# EAGLE design +(3.3, 5, 9, 12) (EAGLE 9.6.2)
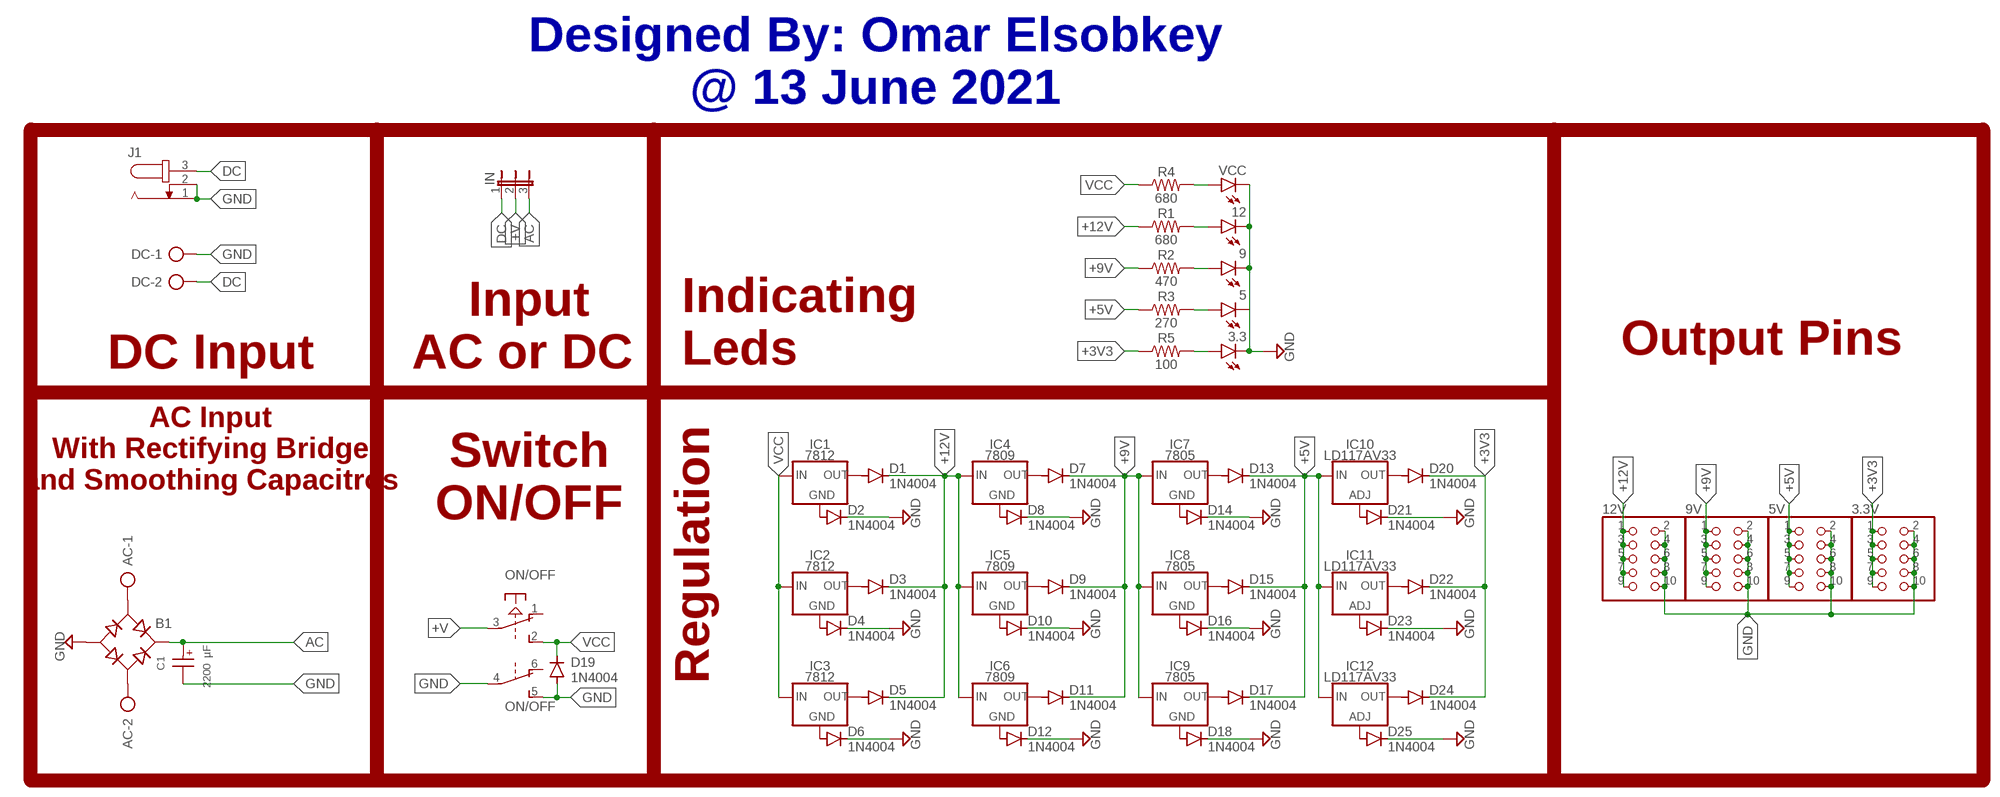
[diagram p0: schematic, sheet 1]

## Parts
3.3  LED5MM  [LED5MM]
3.3V  PINHD-2X5  [2X05]
5  LED5MM  [LED5MM]
5V  PINHD-2X5  [2X05]
9  LED5MM  [LED5MM]
9V  PINHD-2X5  [2X05]
12  LED5MM  [LED5MM]
12V  PINHD-2X5  [2X05]
AC  AK500/2-H  [AK500/2-H]
B1  RB1A  [RB1A]
C1  2200 µF  WCAP-ATG8_16X25_860010580021  [WCAP-ATG8_16X25(DXL)]
D1  1N4004  [DO41-10]
D2  1N4004  [DO41-10]
D3  1N4004  [DO41-10]
D4  1N4004  [DO41-10]
D5  1N4004  [DO41-10]
D6  1N4004  [DO41-10]
D7  1N4004  [DO41-10]
D8  1N4004  [DO41-10]
D9  1N4004  [DO41-10]
D10  1N4004  [DO41-10]
D11  1N4004  [DO41-10]
D12  1N4004  [DO41-10]
D13  1N4004  [DO41-10]
D14  1N4004  [DO41-10]
D15  1N4004  [DO41-10]
D16  1N4004  [DO41-10]
D17  1N4004  [DO41-10]
D18  1N4004  [DO41-10]
D19  1N4004  [DO41-10]
D20  1N4004  [DO41-10]
D21  1N4004  [DO41-10]
D22  1N4004  [DO41-10]
D23  1N4004  [DO41-10]
D24  1N4004  [DO41-10]
D25  1N4004  [DO41-10]
DC  AK500/2-H  [AK500/2-H]
IC1  7812  78XXS  [78XXS]
IC2  7812  78XXS  [78XXS]
IC3  7812  78XXS  [78XXS]
IC4  7809  78XXS  [78XXS]
IC5  7809  78XXS  [78XXS]
IC6  7809  78XXS  [78XXS]
IC7  7805  78XXS  [78XXS]
IC8  7805  78XXS  [78XXS]
IC9  7805  78XXS  [78XXS]
IC10  LD117AV33  [TO220L1]
IC11  LD117AV33  [TO220L1]
IC12  LD117AV33  [TO220L1]
IN  JP2E  [JP2]
J1  JACK-PLUG0  [SPC4077]
ON/OFF  PVA2R  [PVA2R]
R1  680  RESISTORAXIAL-0.3  [AXIAL-0.3]
R2  470  RESISTORAXIAL-0.3  [AXIAL-0.3]
R3  270  RESISTORAXIAL-0.3  [AXIAL-0.3]
R4  680  RESISTORAXIAL-0.3  [AXIAL-0.3]
R5  100  RESISTORAXIAL-0.3  [AXIAL-0.3]
VCC  LED5MM  [LED5MM]

## Nets
+3V3: 3.3V.1 3.3V.3 3.3V.5 3.3V.7 3.3V.9 D20.C D22.C D24.C R5.P$1
+5V: 5V.1 5V.3 5V.5 5V.7 5V.9 D13.C D15.C D17.C IC10.3(IN) IC11.3(IN) IC12.3(IN) R3.P$1
+9V: 9V.1 9V.3 9V.5 9V.7 9V.9 D7.C D9.C D11.C IC7.IN IC8.IN IC9.IN R2.P$1
+12V: 12V.1 12V.3 12V.5 12V.7 12V.9 D1.C D3.C D5.C IC4.IN IC5.IN IC6.IN R1.P$1
+V: IN.2 ON/OFF.3(1:P)
AC: B1.+ C1.1(+) IN.3
DC: DC.2 IN.1 J1.3
GND: 3.3.K(C) 3.3V.2 3.3V.4 3.3V.6 3.3V.8 3.3V.10 5.K(C) 5V.2 5V.4 5V.6 5V.8 5V.10 9.K(C) 9V.2 9V.4 9V.6 9V.8 9V.10 12.K(C) 12V.2 12V.4 12V.6 12V.8 12V.10 B1.- C1.2(-) D2.C D4.C D6.C D8.C D10.C D12.C D14.C D16.C D18.C D19.A D21.C D23.C D25.C DC.1 J1.1 J1.2 ON/OFF.4(2:P) ON/OFF.5(2:S) VCC.K(C)
N$1: AC.1 B1.AC1
N$2: AC.2 B1.AC2
N$3: 3.3.A R5.P$2
N$4: R4.P$2 VCC.A
N$5: D21.A IC10.1(ADJ)
N$6: D1.A IC1.OUT
N$7: D2.A IC1.GND
N$8: D3.A IC2.OUT
N$9: D4.A IC2.GND
N$10: D5.A IC3.OUT
N$11: D6.A IC3.GND
N$12: D7.A IC4.OUT
N$13: D8.A IC4.GND
N$14: D9.A IC5.OUT
N$15: D10.A IC5.GND
N$16: D11.A IC6.OUT
N$17: D12.A IC6.GND
N$18: D13.A IC7.OUT
N$19: D14.A IC7.GND
N$20: D15.A IC8.OUT
N$21: D16.A IC8.GND
N$22: D17.A IC9.OUT
N$23: D18.A IC9.GND
N$24: 12.A R1.P$2
N$25: 9.A R2.P$2
N$26: 5.A R3.P$2
N$27: D22.A IC11.2(OUT)
N$28: D23.A IC11.1(ADJ)
N$29: D24.A IC12.2(OUT)
N$30: D25.A IC12.1(ADJ)
N$31: D20.A IC10.2(OUT)
VCC: D19.C IC1.IN IC2.IN IC3.IN ON/OFF.2(1:S) R4.P$1
Unconnected: ON/OFF.1(1:O) ON/OFF.6(2:O)

## Notes on the sheet
- Designed By: Omar Elsobkey
  @ 13 June 2021
- DC Input | Output Pins
- Input
  AC or DC
- Indicating
  Leds
- AC Input
  With Rectifying Bridge
  and Smoothing Capacitros
- Switch
  ON/OFF
- Regulation

## Library data of the parts
3.3 5 9 12 VCC = led:LED: LED OSRAM: - CHIPLED LG R971, LG N971, LY N971, LG Q971, LY Q971, LO R971, LY R971 LH N974, LH R974 LS Q976, LO Q976, LY Q976 LO Q996 - Hyper CHIPLED LW Q18S LB Q993, LB Q99A, LB R99A - SideLED LS A670, LO A670, LY A670, LG A670, LP A670 LB A673, LV A673, LT A673, LW A673 LH A674 LY A675 LS A676, LA A676, LO A676, LY A676, LW A676 LS A679, LY A679, LG A679 - Hyper Micro SIDELED® LS Y876, LA Y876, LO Y876, LY Y876 LT Y87S - SmartLED LW L88C, LW L88S LB L89C, LB L89S, LG L890 LS L89K, LO L89K, LY L89K LS L896, LA L896, LO L896, LY L896 - TOPLED LS T670, LO T670, LY T670, LG T670, LP T670 LSG T670, LSP T670, LSY T670, LOP T670, LYG T670 LG T671, LOG T671, LSG T671 LB T673, LV T673, LT T673, LW T673 LH T674 LS T676, LA T676, LO T676, LY T676, LB T676, LH T676, LSB T676, LW T676 LB T67C, LV T67C, LT T67C, LS T67K, LO T67K, LY T67K, LW E67C LS E67B, LA E67B, LO E67B, LY E67B, LB E67C, LV E67C, LT E67C LW T67C LS T679, LY T679, LG T679 LS T770, LO T770, LY T770, LG T770, LP T770 LB T773, LV T773, LT T773, LW T773 LH T774 LS E675, LA E675, LY E675, LS T675 LS T776, LA T776, LO T776, LY T776, LB T776 LHGB T686 LT T68C, LB T68C - Hyper Mini TOPLED® LB M676 - Mini TOPLED Santana® LG M470 LS M47K, LO M47K, LY M47K Source: http://www.osram.convergy.de LUXEON: - LUMILED® LXK2-PW12-R00, LXK2-PW12-S00, LXK2-PW14-U00, LXK2-PW14-V00 LXK2-PM12-R00, LXK2-PM12-S00, LXK2-PM14-U00 LXK2-PE12-Q00, LXK2-PE12-R00, LXK2-PE12-S00, LXK2-PE14-T00, LXK2-PE14-U00 LXK2-PB12-K00, LXK2-PB12-L00, LXK2-PB12-M00, LXK2-PB14-N00, LXK2-PB14-P00, LXK2-PB14-Q00 LXK2-PR12-L00, LXK2-PR12-M00, LXK2-PR14-Q00, LXK2-PR14-R00 LXK2-PD12-Q00, LXK2-PD12-R00, LXK2-PD12-S00 LXK2-PH12-R00, LXK2-PH12-S00 LXK2-PL12-P00, LXK2-PL12-Q00, LXK2-PL12-R00 Source: www.luxeon.com KINGBRIGHT: KA-3528ASYC Source: www.kingbright.com
3.3V 5V 9V 12V = pinhead:PINHD-2X5: PIN HEADER
AC DC = con-ptr500:AK500/2-H: CONNECTOR Aug. 2004 / PTR Meßtechnik: Die Bezeichnung der Serie AK505 wurde geändert. Es handelt sich hierbei um AK500 in horizontaler Ausführung.; OC_FARNELL: unknown; OC_NEWARK: unknown
B1 = rectifier:RB1A: RECTIFIER 1 A
C1 = Wurth_Capacitors_WCAP-ATG8:WCAP-ATG8_16X25: WCAP-ATG8 Aluminium Electrolytic Capacitors General Purpose +85 °C Characteristics General purpose product series with max. operating temperature of +85 °C Wide range of capacitance value Mounting style: THT Radial Capacitance range: 0.1 µF ‒ 33000 µF Capacitance tolerance: ±20 % Voltage range (UR): 10 ‒ 400 V(DC) Operating temperature: -40 °C up to +85 °C for UR < 400 V(DC) -25 °C up to +85 °C for UR ≥ 400 V(DC) Endurance: 2000 h @ +85 °C Dimensions (DxL) in mm: 5.0 x 11.0 up to 22.0 x 51.0 Recommended soldering: Wave soldering Applications Filtering Smoothing Energy storage Coupling <https://www.we-online.com/catalog/media/o35732v209%20WCAP-ATG8_4C.jpg> Details see: https://www.we-online.com/catalog/en/WCAP-ATG8/ Updated by yingchun,Shan;2020-02-27 2020(C) Würth Elektronik; DATASHEET-URL: https://www.we-online.com/catalog/datasheet/860010580021.pdf; DF: 12%; DIAMETER: 16mm; I-LEAK: 770uA; I-RIPPLE: 1870mA; L: 25mm; OPERATING-TEMPERATURE: -40 °C up to +85 °C; PART-NUMBER: 860010580021; PITCH: 7.5mm; TECHNICAL-REFERENCE: ATBK250222M035DSPAEB000; VR: 35V(DC)
D1-D25 = diode:1N4004: DIODE general purpose rectifier, 1 A
IC1-IC9 = v-reg:78XXS: VOLTAGE REGULATOR
IC10-IC12 = v-reg:LD117A?*: Low drop fixed and adjustable positive voltage regulators 1 A Source: http://www.st.com/stonline/products/literature/ds/7194/ld1117axx.pdf
IN = jumper:JP2E: JUMPER
J1 = con-jack:JACK-PLUG: DC POWER JACK Power Jack, DC, Right Angle, Through Hole, Rated 5A at 16VDC, PC Terminals Distributor: Farnell (www.Farnell.de) Drawing: 84N1161.pdf / 84N1162.pdf Manufacturer: SPC Technology (www.spctechnology.com) Type: SPC4077 / SPC 4078; OC_FARNELL: unknown; OC_NEWARK: unknown
ON/OFF = switch-misc:PVA2R: ITT SWITCH
R1-R5 = SparkFun-Resistors:RESISTOR: Generic Resistor Package

## Board
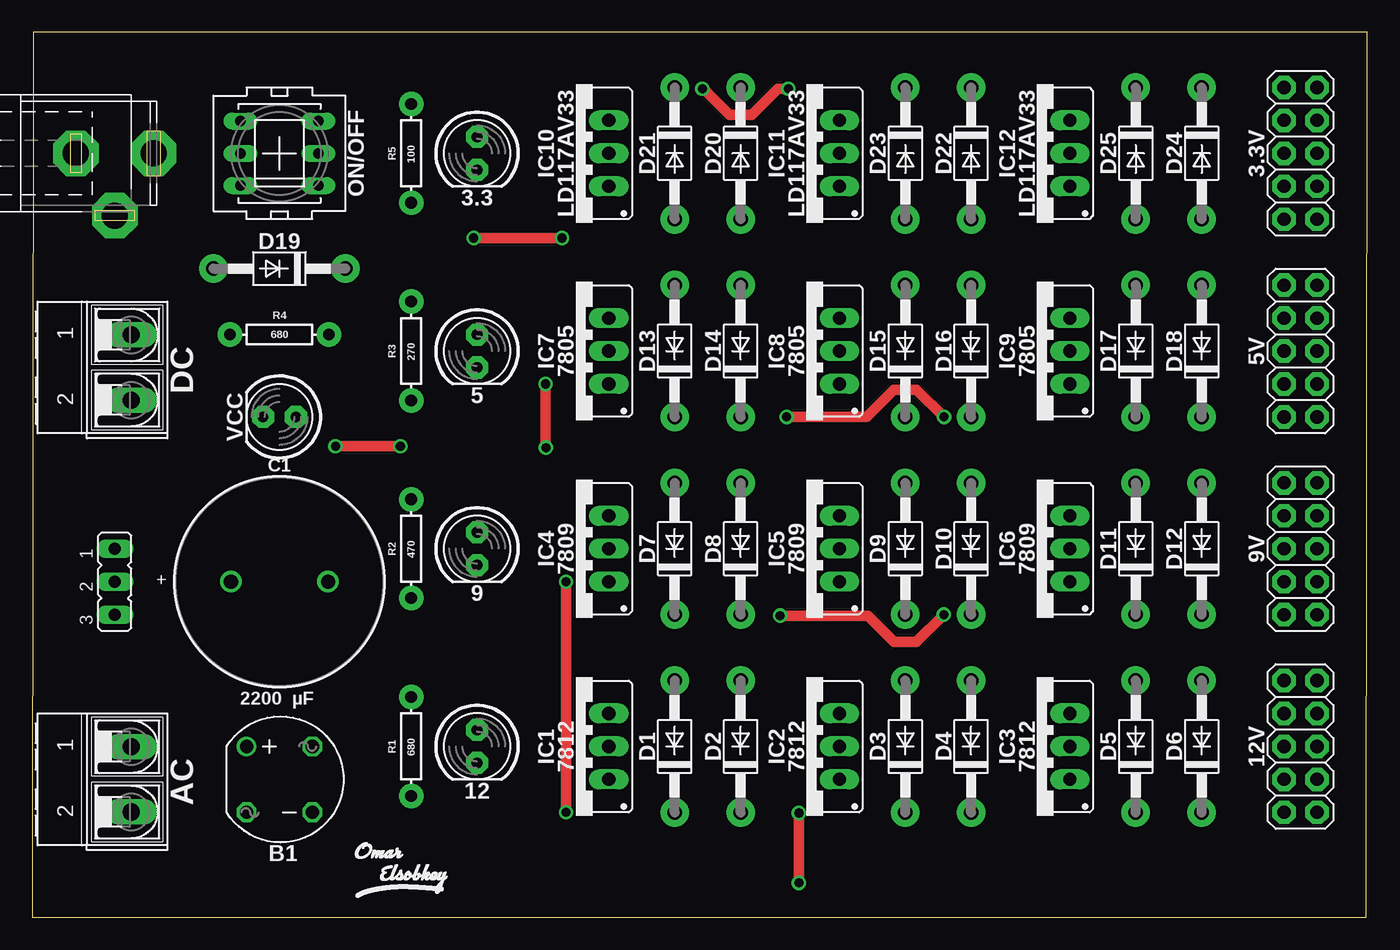
[diagram p1: board, top side]
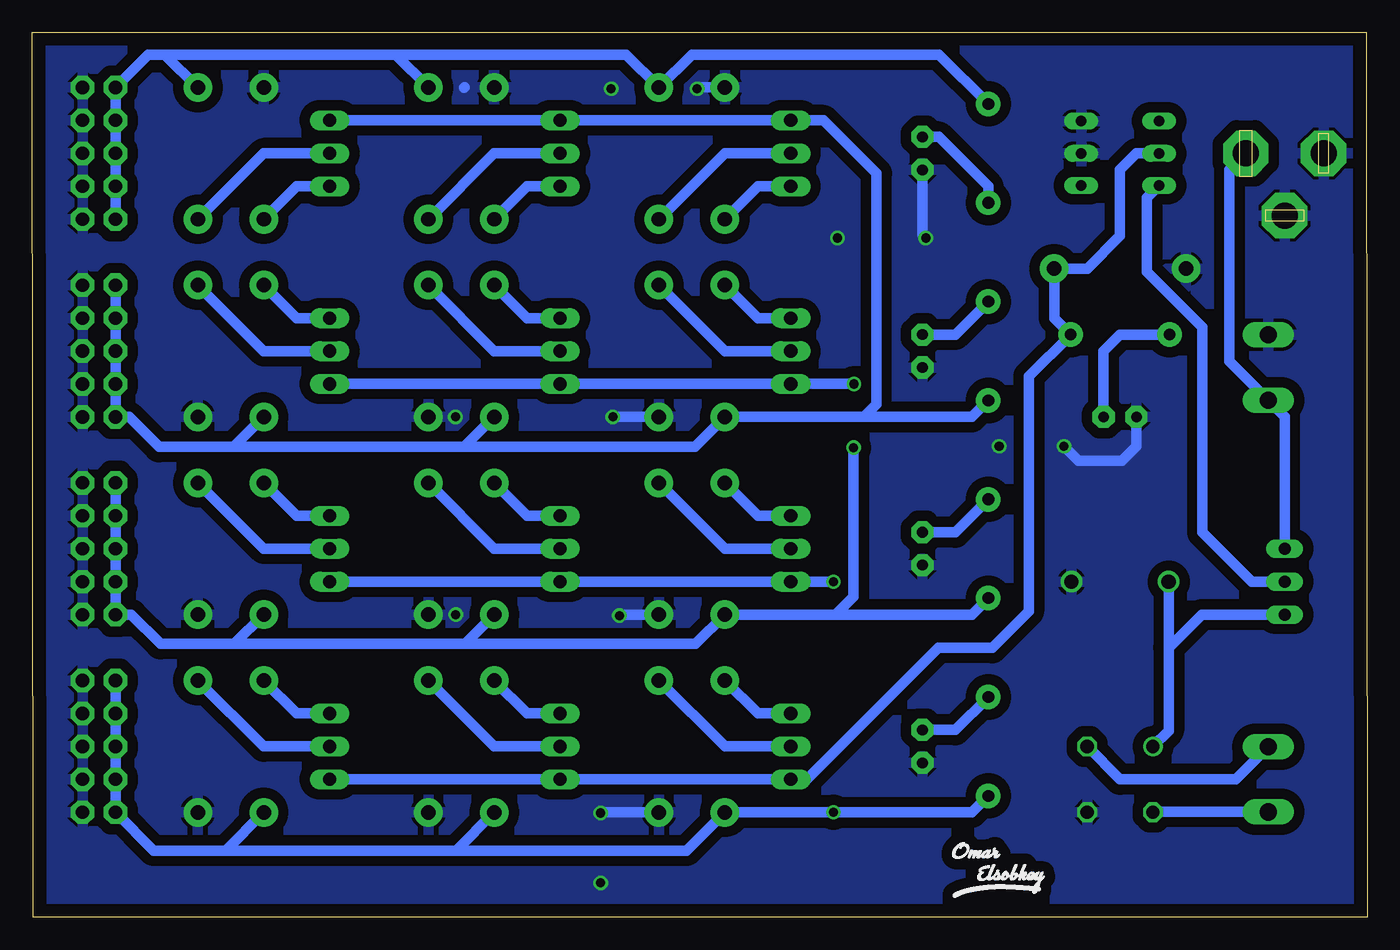
[diagram p2: board, bottom side, seen from below]

Size 102.93 x 68.2 mm. Coordinates in mm from the lower left corner, seen from the top.
Outline: 0,0 102.85,0 102.93,68.2 0.08,68.2 0,0
Copper layers (1*16): Top 0.035mm / dielectric 1.5mm / Bottom 0.035mm
Design rules "default *": minimum track width 0.8mm, minimum drill 0.7mm, track to track 0.6mm, track to pad 0.6mm, pad to pad 0.6mm, via to via 0.6mm, smd to smd 0.6mm, copper to edge 40mil, drill to drill 6mil, minimum pad ring 10mil, minimum via ring 8mil, stop-mask expansion 4mil, vias tented up to drill 0mil, thermal gap 10mil

### Footprints (pad centres in the part's own frame; a part is rotated, then mirrored left to right if it is on the bottom)
LED5MM = drill 0.813 pad 1.7 octagon: A -1.27,0; K 1.27,0
2X05 = drill 1.016 pad 1.8 octagon: 1 -5.08,-1.27; 2 -5.08,1.27; 3 -2.54,-1.27; 4 -2.54,1.27; 5 0,-1.27; 6 0,1.27; 7 2.54,-1.27; 8 2.54,1.27; 9 5.08,-1.27; 10 5.08,1.27
AK500/2-H = drill 1.321 long: 1 -2.515,0; 2 2.515,0
RB1A = drill 1.016: + -2.54,2.54 | drill 1.016 octagon: - 2.54,-2.54; AC1 2.54,2.54; AC2 -2.54,-2.54
WCAP-ATG8_16X25(DXL) = drill 1.1: 1 3.75,0; 2 -3.75,0
DO41-10 = drill 1.118 pad 2.2: A 5.08,0; C -5.08,0
78XXS = drill 1.016 long: GND 0,-2.54; IN -2.54,-2.54; OUT 2.54,-2.54
TO220L1 = drill 1.016 long: 1 -2.54,-2.54; 2 0,-2.54; 3 2.54,-2.54
JP2 = drill 0.914 long: 1 -2.54,0; 2 0,0; 3 2.54,0
SPC4077 = drill 2 pad 3.5 octagon: 1 -3,0; 2 0,-4.8; 3 3,0
PVA2R = drill 0.813 long: 1 -2.997,2.489; 2 -2.997,0; 3 -2.997,-2.489; 4 2.997,2.489; 5 2.997,0; 6 2.997,-2.489
AXIAL-0.3 = drill 0.9 pad 1.88: P$1 -3.81,0; P$2 3.81,0

### Placement (x,y rotation side)
3.3  34.29,58.88 270 top
3.3V  97.79,58.88 270 top
5  34.29,43.64 270 top
5V  97.79,43.64 270 top
9  34.29,28.4 270 top
9V  97.79,28.4 270 top
12  34.29,13.16 270 top
12V  97.79,13.16 270 top
AC  7.62,10.62 270 top
B1  19.05,10.62 0 top
C1  19.05,25.86 180 top
D1  49.53,13.16 90 top
D2  54.61,13.16 90 top
D3  67.31,13.16 90 top
D4  72.39,13.16 90 top
D5  85.09,13.16 90 top
D6  90.17,13.16 90 top
D7  49.53,28.4 90 top
D8  54.61,28.4 90 top
D9  67.31,28.4 90 top
D10  72.39,28.4 90 top
D11  85.09,28.4 90 top
D12  90.17,28.4 90 top
D13  49.53,43.64 90 top
D14  54.61,43.64 90 top
D15  67.31,43.64 90 top
D16  72.39,43.64 90 top
D17  85.09,43.64 90 top
D18  90.17,43.64 90 top
D19  19.05,49.99 180 top
D20  54.61,58.88 270 top
D21  49.53,58.88 270 top
D22  72.39,58.88 270 top
D23  67.31,58.88 270 top
D24  90.17,58.88 270 top
D25  85.09,58.88 270 top
DC  7.62,42.37 270 top
IC1  41.91,13.16 90 top
IC2  59.69,13.16 90 top
IC3  77.47,13.16 90 top
IC4  41.91,28.4 90 top
IC5  59.69,28.4 90 top
IC6  77.47,28.4 90 top
IC7  41.91,43.64 90 top
IC8  59.69,43.64 90 top
IC9  77.47,43.64 90 top
IC10  41.91,58.88 90 top
IC11  59.69,58.88 90 top
IC12  77.47,58.88 90 top
IN  6.35,25.86 270 top
J1  6.35,58.88 0 top
ON/OFF  19.05,58.88 0 top
R1  29.21,13.16 90 top
R2  29.21,28.4 90 top
R3  29.21,43.64 90 top
R4  19.05,44.91 180 top
R5  29.21,58.88 270 top
U$1  [OMAR_ELSOBKEY_X0.5_T]  28.78,3.44 0 bottom
U$2  [OMAR_ELSOBKEY_X0.5_TN]  28.78,3.44 0 bottom
U$3  [OMAR_ELSOBKEY_X0.5_TN]  28.09,3.44 0 top
VCC  19.05,38.56 180 top

### Tracks (layer width: path | path; a pad name or v marks a point on that pad's centre or on a via)
+3V3
  Bottom 0.8: 3.3V.9 3.3V.7 3.3V.5 3.3V.3 3.3V.1 93.98,66.5 92.71,66.5 | 74.93,66.5 57.15,66.5 D20.C 52.07,66.5 33.02,66.5 R5.P$1 | 74.93,66.5 92.71,66.5 | D24.C 92.71,66.5 | D22.C 74.93,66.5
+5V
  Bottom 0.8: 69.62,36.25 51.84,36.25 D13.C 38.79,38.56 | 69.62,36.25 87.4,36.25 | 87.4,36.25 93.17,36.25 95.48,38.56 5V.9 5V.7 5V.5 5V.3 5V.1 | 38.79,38.56 30.48,38.56 R3.P$1 | D15.C 69.62,36.25 | D17.C 87.4,36.25 | IC12.3 IC11.3 IC10.3 41.91,61.42 37.82,57.33 37.82,39.52 38.79,38.56
+9V  (via drill 0.7)
  Top 0.8: v39.6,36.2 39.58,36.22 v39.58,41.1
  Bottom 0.8: IC9.IN IC8.IN IC7.IN v39.58,41.1 | 69.57,21.06 51.79,21.06 D7.C 41,23.32 | 69.57,21.06 87.35,21.06 | 87.35,21.06 93.04,21.06 95.3,23.32 9V.9 9V.7 9V.5 9V.3 9V.1 | R2.P$1 30.48,23.32 41,23.32 | D11.C 87.35,21.06 | D9.C 69.57,21.06 | v39.6,36.2 39.6,24.72 41,23.32
+12V  (via drill 0.7)
  Top 0.8: v41.15,25.86 v41.15,8.08
  Bottom 0.8: IC6.IN IC5.IN IC4.IN v41.15,25.86 | 70.26,5.13 52.48,5.13 D1.C v41.15,8.08 30.48,8.08 R1.P$1 | 70.26,5.13 88.04,5.13 | 12V.1 12V.3 12V.5 12V.7 12V.9 93.57,5.13 88.04,5.13 | D3.C 70.26,5.13 | D5.C 88.04,5.13
+V
  Bottom 0.8: IN.2 8.89,25.86 12.7,29.67 12.7,45.47 16.97,49.74 16.97,55.48 ON/OFF.3
AC
  Bottom 0.8: C1.1 15.3,20.78 | 15.3,20.78 15.3,14.37 B1.+ | IN.3 12.76,23.32 15.3,20.78
DC
  Bottom 0.8: IN.1 6.35,38.56 7.62,39.83 DC.2 10.62,42.85 10.62,57.61 J1.3
GND  (via drill 0.7)
  Top 0.8: v23.37,36.3 v28.37,36.3 | v59.11,8.03 v59.11,2.64 | v57.66,23.24 64.42,23.24 66.44,21.22 68.18,21.22 v70.28,23.32 | v58.17,38.56 64.34,38.56 66.44,40.66 68.18,40.66 70.28,38.56 v70.31,38.56 | v51.66,63.86 51.74,63.86 53.74,61.86 55.48,61.86 57.48,63.86 v58.29,63.86 | v34.04,52.35 v40.84,52.35
  Bottom 0.8: VCC.K 17.78,36.3 18.9,35.18 22.25,35.18 v23.37,36.3 | D2.C 59.05,8.08 v59.11,8.03 | D8.C 57.58,23.32 v57.66,23.24 | D14.C v58.17,38.56 | D21.C 51.56,63.96 v51.66,63.86 | 69.6,63.96 69.62,63.94 | 3.3.K 34.29,52.61 v34.04,52.35
  pour Bottom (isolate 0.8): -3.91,70.67 106.48,70.67 106.48,0.23 -3.91,0.23
N$1
  Bottom 0.8: AC.1 10.13,10.62 19.05,10.62 B1.AC1
N$2
  Bottom 0.8: AC.2 16.48,8.11 B1.AC2
N$3
  Bottom 0.8: R5.P$2 29.21,56.34 33.02,60.15 3.3.A
N$4
  Bottom 0.8: R4.P$2 19.05,44.91 20.32,43.64 VCC.A
N$5
  Bottom 0.8: IC10.1 46.99,56.34 D21.A
N$6
  Bottom 0.8: IC1.OUT 46.99,15.7 D1.A
N$7
  Bottom 0.8: IC1.GND 49.53,13.16 D2.A
N$8
  Bottom 0.8: IC2.OUT 64.77,15.7 D3.A
N$9
  Bottom 0.8: IC2.GND 67.31,13.16 D4.A
N$10
  Bottom 0.8: IC3.OUT 82.55,15.7 D5.A
N$11
  Bottom 0.8: IC3.GND 85.09,13.16 D6.A
N$12
  Bottom 0.8: IC4.OUT 46.99,30.94 D7.A
N$13
  Bottom 0.8: IC4.GND 49.53,28.4 D8.A
N$14
  Bottom 0.8: IC5.OUT 64.77,30.94 D9.A
N$15
  Bottom 0.8: IC5.GND 67.31,28.4 D10.A
N$16
  Bottom 0.8: IC6.OUT 82.55,30.94 D11.A
N$17
  Bottom 0.8: IC6.GND 85.09,28.4 D12.A
N$18
  Bottom 0.8: D13.A 46.99,46.18 IC7.OUT
N$19
  Bottom 0.8: D14.A 49.53,43.64 IC7.GND
N$20
  Bottom 0.8: IC8.OUT 64.77,46.18 D15.A
N$21
  Bottom 0.8: IC8.GND 67.31,43.64 D16.A
N$22
  Bottom 0.8: IC9.OUT 82.55,46.18 D17.A
N$23
  Bottom 0.8: IC9.GND 85.09,43.64 D18.A
N$24
  Bottom 0.8: R1.P$2 31.75,14.43 12.A
N$25
  Bottom 0.8: R2.P$2 31.75,29.67 9.A
N$26
  Bottom 0.8: R3.P$2 31.75,44.91 5.A
N$27
  Bottom 0.8: IC11.2 67.31,58.88 D22.A
N$28
  Bottom 0.8: IC11.1 64.77,56.34 D23.A
N$29
  Bottom 0.8: IC12.2 85.09,58.88 D24.A
N$30
  Bottom 0.8: IC12.1 82.55,56.34 D25.A
N$31
  Bottom 0.8: IC10.2 49.53,58.88 D20.A
VCC
  Bottom 0.8: ON/OFF.2 17.78,58.88 19.05,57.61 19.05,52.53 21.59,49.99 D19.C 24.13,46.18 R4.P$1 26.09,41.68 26.09,23.57 28.91,20.75 33.07,20.75 43.2,10.62 IC1.IN IC2.IN IC3.IN